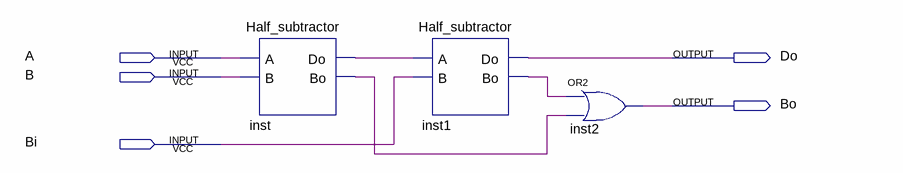
[diagram p0: schematic sheet]
// Quartus schematic Full_subtractor_S.bdf as structural Verilog: 3 symbols, 5 pins
module Full_subtractor_S (
  input  A,
  input  B,
  input  Bi,
  output Do,
  output Bo
);

  wire inst1_bo, inst_bo, inst_do;

  Half_subtractor inst (.A(A), .B(B), .Do(inst_do), .Bo(inst_bo));
  Half_subtractor inst1 (.A(inst_do), .B(Bi), .Do(Do), .Bo(inst1_bo));
  or inst2 (Bo, inst1_bo, inst_bo);
endmodule
